# Altium schematic sheet MCU.SchDoc: MCU.SchDoc
size A4; Organization: Altium Limited; Address1: L3, 12a Rodborough Rd; Address2: Frenchs Forest; Address3: NSW; Address4: Australia 2086
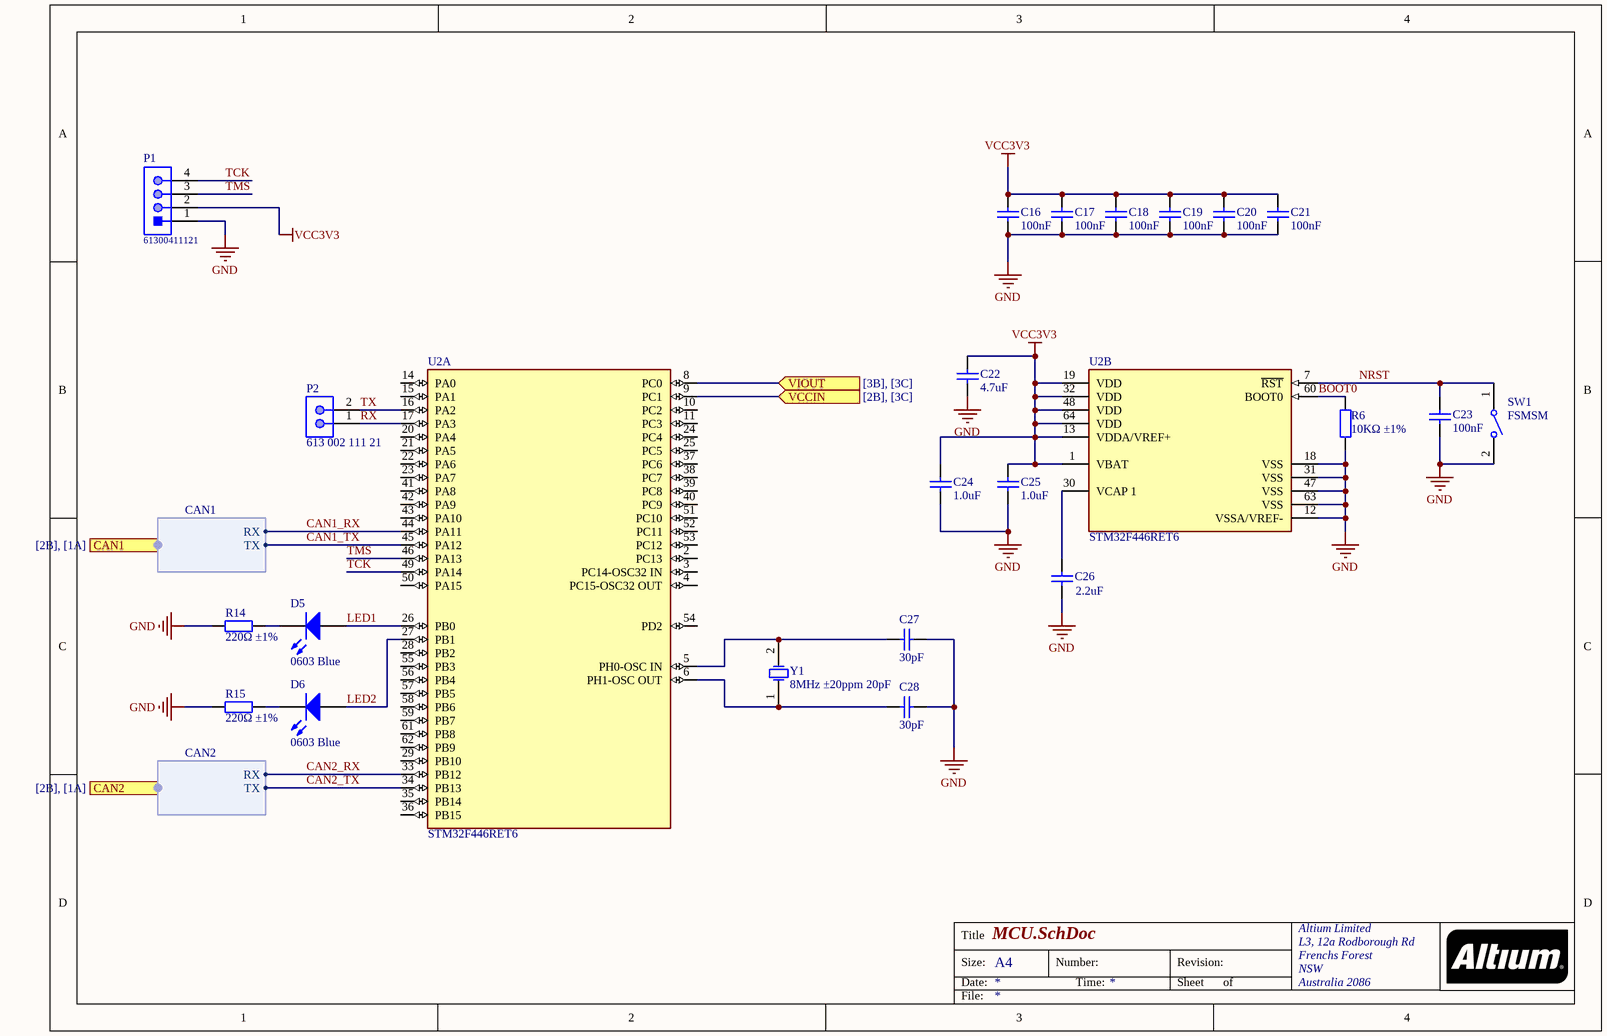
[diagram p0: MCU.SchDoc]

## Parts
C16  100nF  [0402_C]
C17  100nF  [0402_C]
C18  100nF  [0402_C]
C19  100nF  [0402_C]
C20  100nF  [0402_C]
C21  100nF  [0402_C]
C22  4.7uF  [0402_C]
C23  100nF  [0402_C]
C24  1.0uF  [0402_C]
C25  1.0uF  [0402_C]
C26  2.2uF  [0603_C]
C27  30pF  [0402_C]
C28  30pF  [0402_C]
D5  0603 Blue  [0603_LED_S1]
D6  0603 Blue  [0603_LED_S1]
P1  61300411121  [61300411121]
P2  613 002 111 21  [WE-61300211121_V]
R6  10KΩ ±1%  [0805_R]
R14  220Ω ±1%  [0402_R]
R15  220Ω ±1%  [0402_R]
SW1  FSMSM  [TECO-FSMSM-2_V]
U2  STM32F446RET6  [FP-LQFP64-5W-MFG]  (parts A,B of 2)
Y1  8MHz ±20ppm 20pF  [SMD-5032_2P]

## Ports
CAN1 (harness CAN1, see [2B], [1A]), CAN2 (harness CAN2, see [2B], [1A]), VCCIN (in, see [2B], [3C]), VIOUT (in, see [3B], [3C])

## Harnesses
CAN1: RX, TX
CAN2: RX, TX

## Nets
GND: C16.1 C17.1 C18.1 C19.1 C20.1 C21.1 C22.1 C23.1 C24.1 C25.1 C26.1 C27.2 C28.2 P1.1 R6.1 R14.1 R15.1 SW1.2 U2.12(VSSA/VREF-) U2.18(VSS) U2.31(VSS) U2.47(VSS) U2.63(VSS)
VCC3V3: C16.2 C17.2 C18.2 C19.2 C20.2 C21.2 C22.2 C24.2 C25.2 P1.2 U2.1(VBAT) U2.13(VDDA/VREF+) U2.19(VDD) U2.32(VDD) U2.48(VDD) U2.64(VDD)
BOOT0: R6.2 U2.60(BOOT0)
CAN1_RX: U2.44(PA11) ; port CAN1.RX
CAN1_TX: U2.45(PA12) ; port CAN1.TX
CAN2_RX: U2.33(PB12) ; port CAN2.RX
CAN2_TX: U2.34(PB13) ; port CAN2.TX
LED1: D5.A U2.26(PB0)
LED2: D6.A U2.27(PB1)
NRST: C23.2 SW1.1 U2.7(~{RST})
RX: P2.1 U2.17(PA3)
TCK: P1.4 U2.49(PA14)
TMS: P1.3 U2.46(PA13)
TX: P2.2 U2.16(PA2)
VCCIN: U2.9(PC1) ; port VCCIN
VIOUT: U2.8(PC0) ; port VIOUT
NetC26_2: C26.2 U2.30(VCAP_1)
NetC27_1: C27.1 U2.5(PH0-OSC_IN) Y1.2(OSC2)
NetC28_1: C28.1 U2.6(PH1-OSC_OUT) Y1.1(OSC1)
NetD5_K: D5.K R14.2
NetD6_K: D6.K R15.2

Not connected (* = marked no-connect by the designer): U2 2(PC13) 3(PC14-OSC32_IN) 4(PC15-OSC32_OUT) 10(PC2) 11(PC3) 14(PA0) 15(PA1) 20(PA4) 21(PA5) 22(PA6) 23(PA7) 24(PC4) 25(PC5) 28(PB2) 29(PB10) 35(PB14) 36(PB15) 37(PC6) 38(PC7) 39(PC8) 40(PC9) 41(PA8) 42(PA9) 43(PA10) 50(PA15) 51(PC10) 52(PC11) 53(PC12) 54(PD2) 55(PB3) 56(PB4) 57(PB5) 58(PB6) 59(PB7) 61(PB8) 62(PB9)

## Notes on the sheet
- Title
- Size:
- Date:
- A4
- Number:
- Time:
- Revision:
- Sheet
- of
- File:

## Library data of the parts
C16-C21 C23 = 0402 100nF (104) 10% 16V: Chip capacitors; Manufacturer: Samsung Electro-Mechanics; PartNumber: CL05B104KO5NNNC; Tolerance: 10%; Voltage: 16V; ComponentLink1Description: Supplier link; ComponentLink1URL: http://www.szlcsc.com/product/details_1877.html; Package: 0402; Supplier: LC; SuppliersPartNumber: C1525; Capacitance: 100nF
C22 = 0402 4.7uF (475) 20% 10V: Chip capacitor; Manufacturer: Samsung Electro-Mechanics; PartNumber: CL05A475MP5NRNC; Tolerance: 20%; Voltage: 10V; ComponentLink1Description: Supplier link; ComponentLink1URL: http://www.szlcsc.com/product/details_24469.html; Package: 0402; Supplier: LC; SuppliersPartNumber: C23733; Capacitance: 4.7uF
C24 C25 = 0402 1.0uF (105) 10% 25V: Chip capacitor; Manufacturer: Samsung Electro-Mechanics; PartNumber: CL05A105KA5NQNC; Capacitance: 1uF; Tolerance: 10%; Voltage: 25V; ComponentLink1Description: Supplier link; ComponentLink1URL: http://www.szlcsc.com/product/details_53938.html; Package: 0402; Supplier: LC; SuppliersPartNumber: C52923
C26 = 0603 2.2uF (225) 10% 16V: Chip capacitors; Manufacturer: Samsung Electro-Mechanics; PartNumber: CL10A225KO8NNNC; Tolerance: 10%; Voltage: 16V; ComponentLink1Description: Supplier link; ComponentLink1URL: http://www.szlcsc.com/product/details_24366.html; Package: 0603; Supplier: LC; SuppliersPartNumber: C23630; Capacitance: 2.2uF
C27 C28 = 0402 30pF (300) 5% 50V: Chip capacitors; Manufacturer: Guangdong Fenghua Advanced Tech; PartNumber: 0402CG300J500NT; Tolerance: 5%; Voltage: 50V; ComponentLink1Description: Supplier link; ComponentLink1URL: http://www.szlcsc.com/product/details_1922.html; Package: 0402; Supplier: LC; SuppliersPartNumber: C1570; Capacitance: 30pF
D5 D6 = 0603 LED Blue: LED; ComponentLink1Description: 供应商链接; ComponentLink1URL: http://www.szlcsc.com/product/details_73150.html; Package: 0603; Supplier: LC; SuppliersPartNumber: C72041; Color: Blue
P1 = CMP-1502-01064-1: THT Vertical Pin Header WR-PHD, Pitch 2.54 mm, Single Row, 4 pins; Manufacturer: Wurth Elektronik; Withstanding Voltage: 500VAC; Rated Current: 3A; Working Voltage: 250VAC; Pin Number: 4; Gender: Male; Contact Resistance: 20mOhm; Pitch: 2.54mm; Manufacturer URL: http://www.we-online.de; Operating Temperature: -40to105degC; Packaging: Bag; Mounting Technology: THT; Package Reference: 61300411121; Datasheet URL: https://katalog.we-online.de/em/datasheet/6130xx11121.pdf; Publisher: WurthElektronik; Part Number: 61300411121; Row Number: Single; Orientation: Vertical
P2 = CMP-1712-00002-3: Male Header, Pitch 2.54 mm, 1 x 2 Position, Height 8.54 mm, Tail Length 3 mm, -40 to 105 degC, RoHS, Bulk; Mounting Technology: Through Hole; Packaging: Bulk; Pins: 2; REACH SVHC: No SVHC; PartNumber: 613 002 111 21; PackageDescription: Male Header, Pitch 2.54 mm, 1 x 2 Position, Height 8.54 mm, Tail Length 3 mm; ComponentLink1Description: Manufacturer URL; Max Operating Temperature: 125 degC; ComponentLink1URL: https://www.we-online.com/; ComponentLink2Description: Datasheet; Mount: Through Hole; DatasheetVersion: Rev. J; Min Operating Temperature: -40 degC; ComponentLink2URL: http://katalog.we-online.de/em/datasheet/6130xx11121.pdf; RoHSCompliant: True
R6 = 0805 10K (1002) 1%: Chip resistor; Manufacturer: Uniroyal Elec; Power: 1/8W; ComponentLink1Description: Supplier link; ComponentLink1URL: http://www.szlcsc.com/product/details_18102.html; Package: 0805; Supplier: LC; SuppliersPartNumber: C17414; Tolerance: 1%
R14 R15 = 0402 220R (2200) 1%: Chip resistor; Manufacturer: Uniroyal Elec; PartNumber: 0402WGF2200TCE; Power: 1/16W; ComponentLink1Description: Supplier link; ComponentLink1URL: http://www.szlcsc.com/product/details_25834.html; Package: 0402; Supplier: LC; SuppliersPartNumber: C25091; Resistance: 220Ω; Tolerance: 1%
SW1 = CMP-2000-07511-1: FSMSM Push Button Switch, 50 mA, -35 to 85 degC, 2-Pin SMD, RoHS, Bulk; Manufacturer: TE Connectivity; Actuator Length: 1.07mm; Electrical Life: 20000Cycles; Actuator Material: Polyamide; Current Rating: 50mA; Illumination Type: Illuminated; Voltage Rating (DC): 24V; Contact Resistance: 100mOhm; Case\/Package: SMD/SMT; Operating Force: 180gf; Switch Travel: 0.25mm; Max Voltage Rating (DC): 12V; Throw Configuration: SPST; Packaging: LoosePiece; Max Operating Temperature: 85degC; ELV: Compliant; Package Description: 2-Pin Surface Mount Device, Body 6 x 3.5 mm, Pitch 9.19 mm; RoHSCompliant: true; Manufacturer URL: http://www.te.com/; Contact Plating: Silver; Contact Material: Brass; Mounting Technology: SurfaceMount; Contact Current Rating: 50mA; Datasheet Version: Rev. C2, 08/2014; Datasheet URL: http://www.te.com/commerce/DocumentDelivery/DDEController?Action=showdoc&DocId=Customer+Drawing%7F1437566-3%7FC2%7Fpdf%7FEnglish%7FENG_CD_1437566-3_C2_1437566_3_1_c.dwg.pdf%7F1437566-3; Mechanical Life: 20000Cycles; Package Reference: FSMSM; REACH SVHC: Unknown; Orientation: Straight; Min Operating Temperature: -35degC; Lead Free: LeadFree; Termination: GullWing; Package Quantity: 1000; Mount: SurfaceMount
U2 = CMP-12105-000007-1: IC MCU 32BIT 512KB FLASH 64LQFP; Manufacturer: ST; Number Of Spi Channels: 4; Ram Size: 128KBytes; Standoff Height: 0.05mm; Number Of Uart Channels: 6; Number Of Pwm Channels: 32; Max Junction Temp: +105°C; Number Of I/Os: 50; Number Of Usb Channels: 2; Frequency: 180MHz; Number Of A/D Converters: 3; Max Supply Voltage: 3.6V; Number Of Adc Channels: 16; Interface: I2C,SPI,UART,USART,CAN,USB,LIN,IrDA,I2S,Other; Memory Size: 512KBytes; Number Of Timers/Counters: 14; Min Supply Voltage: 1.7V; Core Architecture: ARM Cortex-M4; Data Bus Width: 32bits; Number Of Cores: 1; Ambient Temperature Range Low: -40°C; ComponentLink2URL: https://www.st.com/en/microcontrollers-microprocessors/stm32f446re.html; Category: IC; Height: 1.6mm; Ipc Land Pattern Name: QFP50P1200X1200X160-64; Manufacturer Part Number: STM32F446RET6; Octopart: https://octopart.com/stm32f446ret6-stmicroelectronics-52642920; Temperature Range High: +105°C; Lead Free: Yes; Mouser Description: ARM Microcontrollers - MCU High-performance and DSP with FP, ARM Cortex-M4 MCU with 512 Kbytes Flash, 180 MHz CPU, Art Accelerator, SDRAM; Digikey Description: IC MCU 32BIT 512KB FLASH 64LQFP; Ambient Temperature Range High: +85°C; Number Of I2C Channels: 4; Memory Type: FLASH; RoHS: TRUE; Automotive: No; Device Class L1: Integrated Circuits (ICs); Temperature: -40°C to +105°C; Device Class L2: Embedded Processors and Controllers; Device Class L3: Microcontrollers; Temperature Range Low: -40°C; Package: LQFP64-5W; ComponentLink2Description: Datasheet
Y1 = SMD-5032_2P 8MHz 20ppm 20pF: 贴片晶振; ComponentLink1Description: 供应商链接; ComponentLink1URL: http://www.szlcsc.com/product/details_117214.html; Package: SMD-5032_2P; Supplier: LC; SuppliersPartNumber: C115962